# Altium schematic sheet SH07-COREPWR.SchDoc
size A4
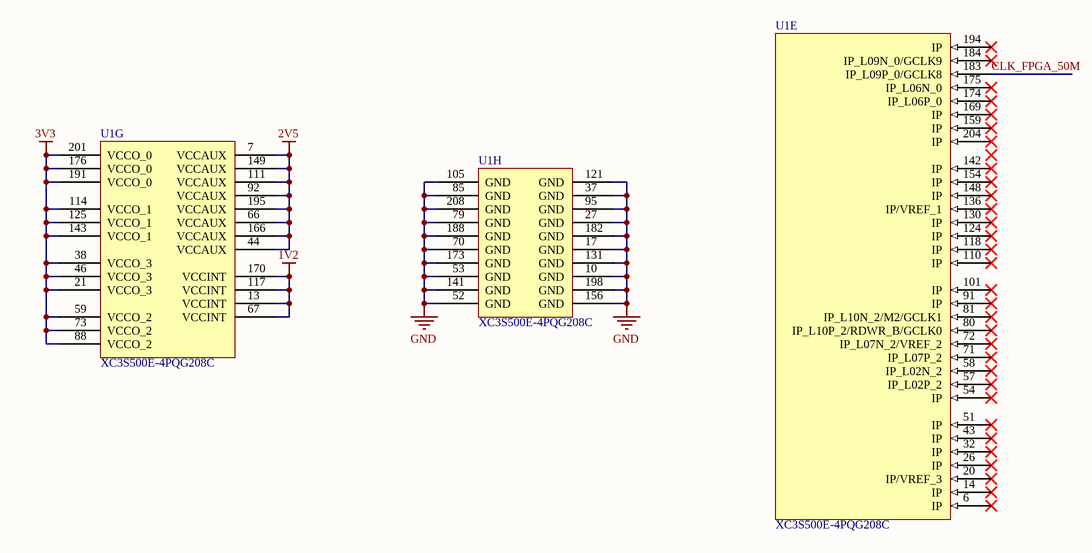
[diagram p0: SH07-COREPWR.SchDoc]

## Parts
U1  XC3S500E-4PQG208C  [PQG208_N]  (parts E,G,H of 8)

## Nets
1V2: U1.13(VCCINT) U1.67(VCCINT) U1.117(VCCINT) U1.170(VCCINT)
2V5: U1.7(VCCAUX) U1.44(VCCAUX) U1.66(VCCAUX) U1.92(VCCAUX) U1.111(VCCAUX) U1.149(VCCAUX) U1.166(VCCAUX) U1.195(VCCAUX)
3V3: U1.21(VCCO_3) U1.38(VCCO_3) U1.46(VCCO_3) U1.59(VCCO_2) U1.73(VCCO_2) U1.88(VCCO_2) U1.114(VCCO_1) U1.125(VCCO_1) U1.143(VCCO_1) U1.176(VCCO_0) U1.191(VCCO_0) U1.201(VCCO_0)
GND: U1.10(GND) U1.17(GND) U1.27(GND) U1.37(GND) U1.52(GND) U1.53(GND) U1.70(GND) U1.79(GND) U1.85(GND) U1.95(GND) U1.105(GND) U1.121(GND) U1.131(GND) U1.141(GND) U1.156(GND) U1.173(GND) U1.182(GND) U1.188(GND) U1.198(GND) U1.208(GND)
CLK_FPGA_50M: U1.183(IP_L09P_0/GCLK8)

Not connected (* = marked no-connect by the designer): U1 6(IP)* 14(IP)* 20(IP/VREF_3)* 26(IP)* 32(IP)* 43(IP)* 51(IP)* 54(IP)* 57(IP_L02P_2)* 58(IP_L02N_2)* 71(IP_L07P_2)* 72(IP_L07N_2/VREF_2)* 80(IP_L10P_2/RDWR_B/GCLK0)* 81(IP_L10N_2/M2/GCLK1)* 91(IP)* 101(IP)* 110(IP)* 118(IP)* 124(IP)* 130(IP)* 136(IP/VREF_1)* 142(IP)* 148(IP)* 154(IP)* 159(IP)* 169(IP)* 174(IP_L06P_0)* 175(IP_L06N_0)* 184(IP_L09N_0/GCLK9)* 194(IP)* 204(IP)*

## Library data of the parts
U1 = XC3S500E-4PQG208C: Spartan-3E 1.2V FPGA, 158 User I/Os, 208-Pin Pb-Free PQFP, Standard Performance, Commercial Grade; Published: 6-Jun-2005; LatestRevisionDate: 13-Apr-2006; LatestRevisionNote: IPC-7351 Footprint Added.; DatasheetVersion: 16-Mar-2007; PackageVersion: ver1.2, Jun-2004; PackageReference: PQG208; Publisher: Altium Limited; PackageDescription: 208-Pin Plastic Quad Flat Pack (PQG208) - Pb-Free; Code_JEDEC: MS-029-FA-1; ComponentLink1Description: Manufacturer Link; ComponentLink1URL: http://www.xilinx.com/products/silicon_solutions/fpgas/spartan_series/spartan3e_fpgas/index.htm; ComponentLink2Description: Datasheet; ComponentLink2URL: http://direct.xilinx.com/bvdocs/publications/ds312.pdf